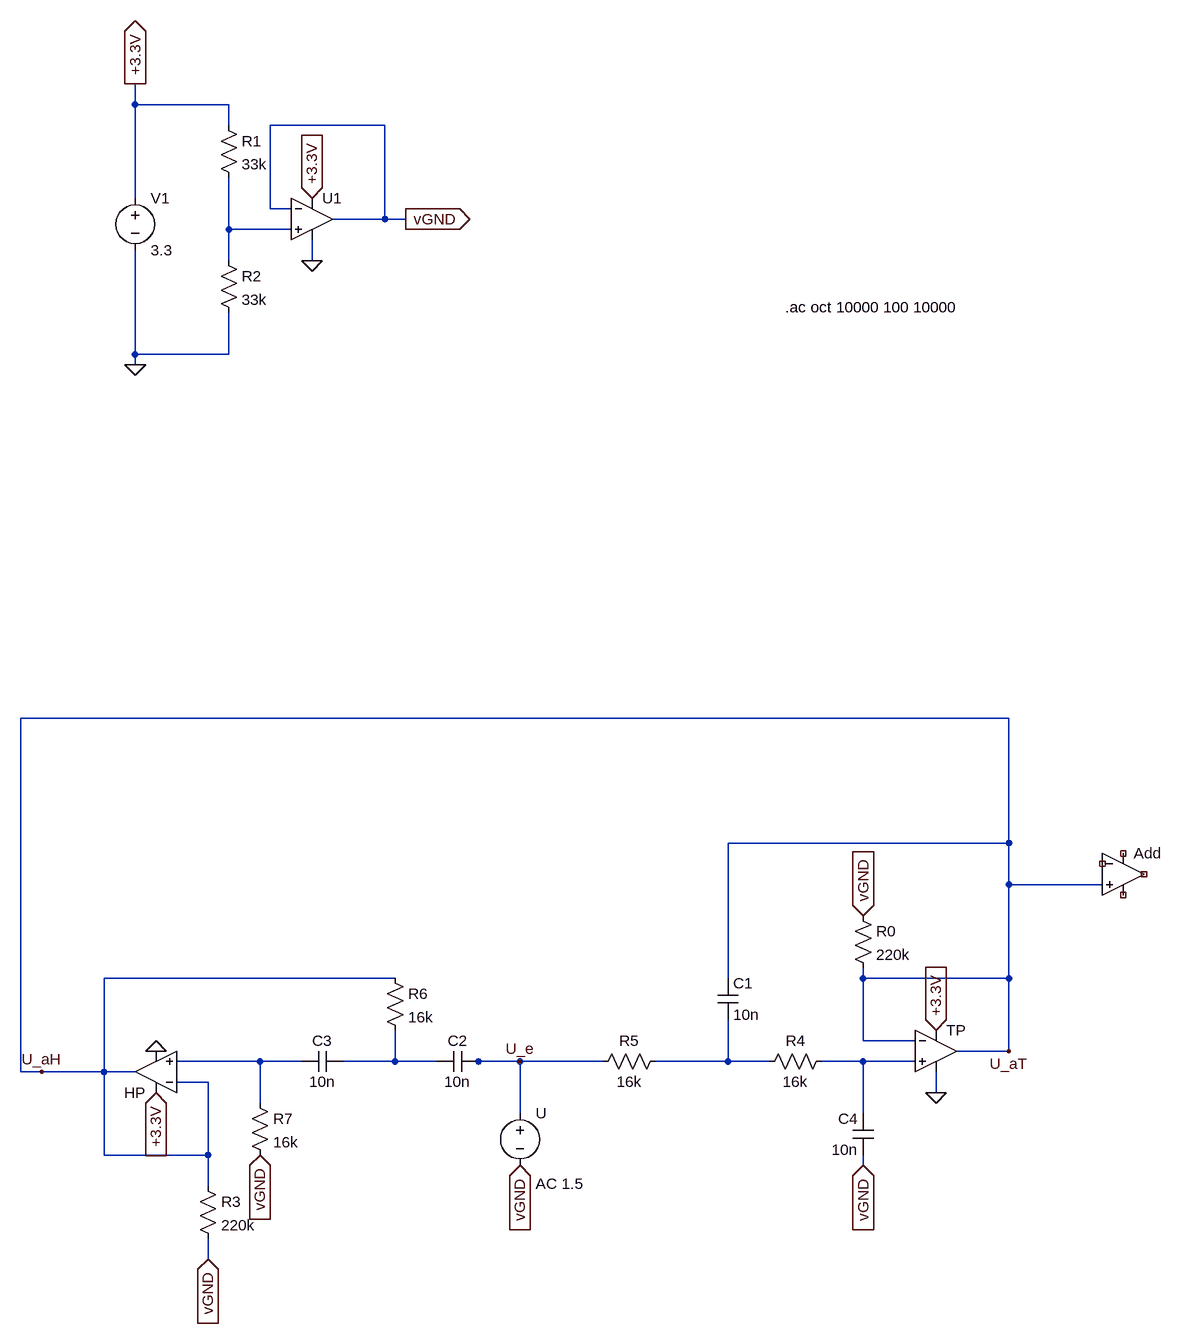
[diagram p0: schematic Circuit_4_2ADD.asc]
Circuit_4_2ADD.asc, the LTspice schematic file:
Version 4
SHEET 1 1892 1884
WIRE 64 -16 64 -48
WIRE 208 -16 64 -16
WIRE 208 16 208 -16
WIRE 448 16 272 16
WIRE 64 128 64 -16
WIRE 272 144 272 16
WIRE 304 144 272 144
WIRE 448 160 448 16
WIRE 448 160 368 160
WIRE 480 160 448 160
WIRE 208 176 208 96
WIRE 304 176 208 176
WIRE 208 224 208 176
WIRE 336 224 336 192
WIRE 64 368 64 208
WIRE 208 368 208 304
WIRE 208 368 64 368
WIRE 64 384 64 368
WIRE 1408 928 -112 928
WIRE 1408 1120 1408 928
WIRE 1408 1120 976 1120
WIRE 1408 1184 1408 1120
WIRE 1552 1184 1408 1184
WIRE 464 1328 16 1328
WIRE 976 1328 976 1120
WIRE 1184 1328 1184 1312
WIRE 1408 1328 1408 1184
WIRE 1408 1328 1184 1328
WIRE 1184 1424 1184 1328
WIRE 1264 1424 1184 1424
WIRE 1408 1440 1408 1328
WIRE 1408 1440 1328 1440
WIRE 256 1456 128 1456
WIRE 320 1456 256 1456
WIRE 464 1456 464 1408
WIRE 464 1456 384 1456
WIRE 528 1456 464 1456
WIRE 592 1456 576 1456
WIRE 656 1456 592 1456
WIRE 784 1456 656 1456
WIRE 976 1456 976 1392
WIRE 976 1456 864 1456
WIRE 1040 1456 976 1456
WIRE 1184 1456 1120 1456
WIRE 1264 1456 1184 1456
WIRE -112 1472 -112 928
WIRE -80 1472 -112 1472
WIRE 16 1472 16 1328
WIRE 16 1472 -80 1472
WIRE 64 1472 16 1472
WIRE 176 1488 128 1488
WIRE 1296 1504 1296 1472
WIRE 256 1520 256 1456
WIRE 656 1536 656 1456
WIRE 1184 1536 1184 1456
WIRE 16 1600 16 1472
WIRE 176 1600 176 1488
WIRE 176 1600 16 1600
WIRE 1184 1616 1184 1600
WIRE 176 1648 176 1600
WIRE 176 1760 176 1728
FLAG 336 224 0
FLAG 336 128 +3.3V
IOPIN 336 128 In
FLAG 64 -48 +3.3V
IOPIN 64 -48 Out
FLAG 64 384 0
FLAG 480 160 vGND
IOPIN 480 160 Out
FLAG 1296 1504 0
FLAG 656 1616 vGND
IOPIN 656 1616 In
FLAG 1184 1616 vGND
IOPIN 1184 1616 In
FLAG 1184 1232 vGND
IOPIN 1184 1232 In
FLAG 1296 1408 +3.3V
IOPIN 1296 1408 In
FLAG 656 1456 U_e
FLAG 1408 1440 U_aT
FLAG 176 1760 vGND
IOPIN 176 1760 In
FLAG 96 1504 +3.3V
IOPIN 96 1504 In
FLAG 96 1440 0
FLAG 256 1600 vGND
IOPIN 256 1600 In
FLAG -80 1472 U_aH
SYMBOL voltage 64 112 R0
WINDOW 123 0 0 Left 0
WINDOW 39 0 0 Left 0
SYMATTR InstName V1
SYMATTR Value 3.3
SYMBOL OpAmps\\UniversalOpAmp2 336 160 R0
SYMATTR InstName U1
SYMBOL res 192 0 R0
SYMATTR InstName R1
SYMATTR Value 33k
SYMBOL res 192 208 R0
SYMATTR InstName R2
SYMATTR Value 33k
SYMBOL voltage 656 1520 R0
WINDOW 123 24 124 Left 2
WINDOW 39 0 0 Left 0
SYMATTR InstName U
SYMATTR Value ""
SYMATTR Value2 AC 1.5
SYMBOL res 880 1440 R90
WINDOW 0 0 56 VBottom 2
WINDOW 3 32 56 VTop 2
SYMATTR InstName R5
SYMATTR Value 16k
SYMBOL cap 960 1328 R0
SYMATTR InstName C1
SYMATTR Value 10n
SYMBOL cap 1200 1600 R180
WINDOW 0 24 56 Left 2
WINDOW 3 24 8 Left 2
SYMATTR InstName C4
SYMATTR Value 10n
SYMBOL res 1136 1440 R90
WINDOW 0 0 56 VBottom 2
WINDOW 3 32 56 VTop 2
SYMATTR InstName R4
SYMATTR Value 16k
SYMBOL OpAmps\\UniversalOpAmp2 1296 1440 R0
SYMATTR InstName TP
SYMBOL res 1168 1216 R0
SYMATTR InstName R0
SYMATTR Value 220k
SYMBOL cap 592 1440 R90
WINDOW 0 0 32 VBottom 2
WINDOW 3 32 32 VTop 2
SYMATTR InstName C2
SYMATTR Value 10n
SYMBOL cap 384 1440 R90
WINDOW 0 0 32 VBottom 2
WINDOW 3 32 32 VTop 2
SYMATTR InstName C3
SYMATTR Value 10n
SYMBOL res 448 1312 R0
SYMATTR InstName R6
SYMATTR Value 16k
SYMBOL OpAmps\\UniversalOpAmp2 96 1472 R180
SYMATTR InstName HP
SYMBOL res 160 1632 R0
SYMATTR InstName R3
SYMATTR Value 220k
SYMBOL res 240 1504 R0
SYMATTR InstName R7
SYMATTR Value 16k
SYMBOL OpAmps\\UniversalOpAmp2 1584 1168 R0
SYMATTR InstName Add
TEXT 1064 296 Left 2 !.ac oct 10000 100 10000

The netlist it stands for:
* Circuit_4_2ADD.asc
V1 +3.3V 0 3.3
XU1 N001 vGND +3.3V 0 vGND level2 Avol=1Meg GBW=10Meg Slew=10Meg Ilimit=25m Rail=0 Vos=0 En=0 Enk=0 In=0 Ink=0 Rin=500Meg  ; pins In+ In- V+ V- OUT
R1 +3.3V N001 33k
R2 N001 0 33k
V§U U_e vGND AC 1.5
R5 N004 U_e 16k
C1 U_aH N004 10n
C4 vGND N005 10n
R4 N005 N004 16k
XTP N005 U_aH +3.3V 0 U_aH level2 Avol=1Meg GBW=10Meg Slew=10Meg Ilimit=25m Rail=0 Vos=0 En=0 Enk=0 In=0 Ink=0 Rin=500Meg  ; pins In+ In- V+ V- OUT
R0 vGND U_aH 220k
C2 U_e N003 10n
C3 N003 N002 10n
R6 U_aH N003 16k
XHP N002 U_aH +3.3V 0 U_aH level2 Avol=1Meg GBW=10Meg Slew=10Meg Ilimit=25m Rail=0 Vos=0 En=0 Enk=0 In=0 Ink=0 Rin=500Meg  ; pins In+ In- V+ V- OUT
R3 U_aH vGND 220k
R7 N002 vGND 16k
XAdd U_aH NC_01 NC_02 NC_03 NC_04 level2 Avol=1Meg GBW=10Meg Slew=10Meg Ilimit=25m Rail=0 Vos=0 En=0 Enk=0 In=0 Ink=0 Rin=500Meg  ; pins In+ In- V+ V- OUT
.ac oct 10000 100 10000
.lib UniversalOpAmp2.lib
.backanno
.end